# Altium schematic sheet 1-Connectors.SchDoc
size A4
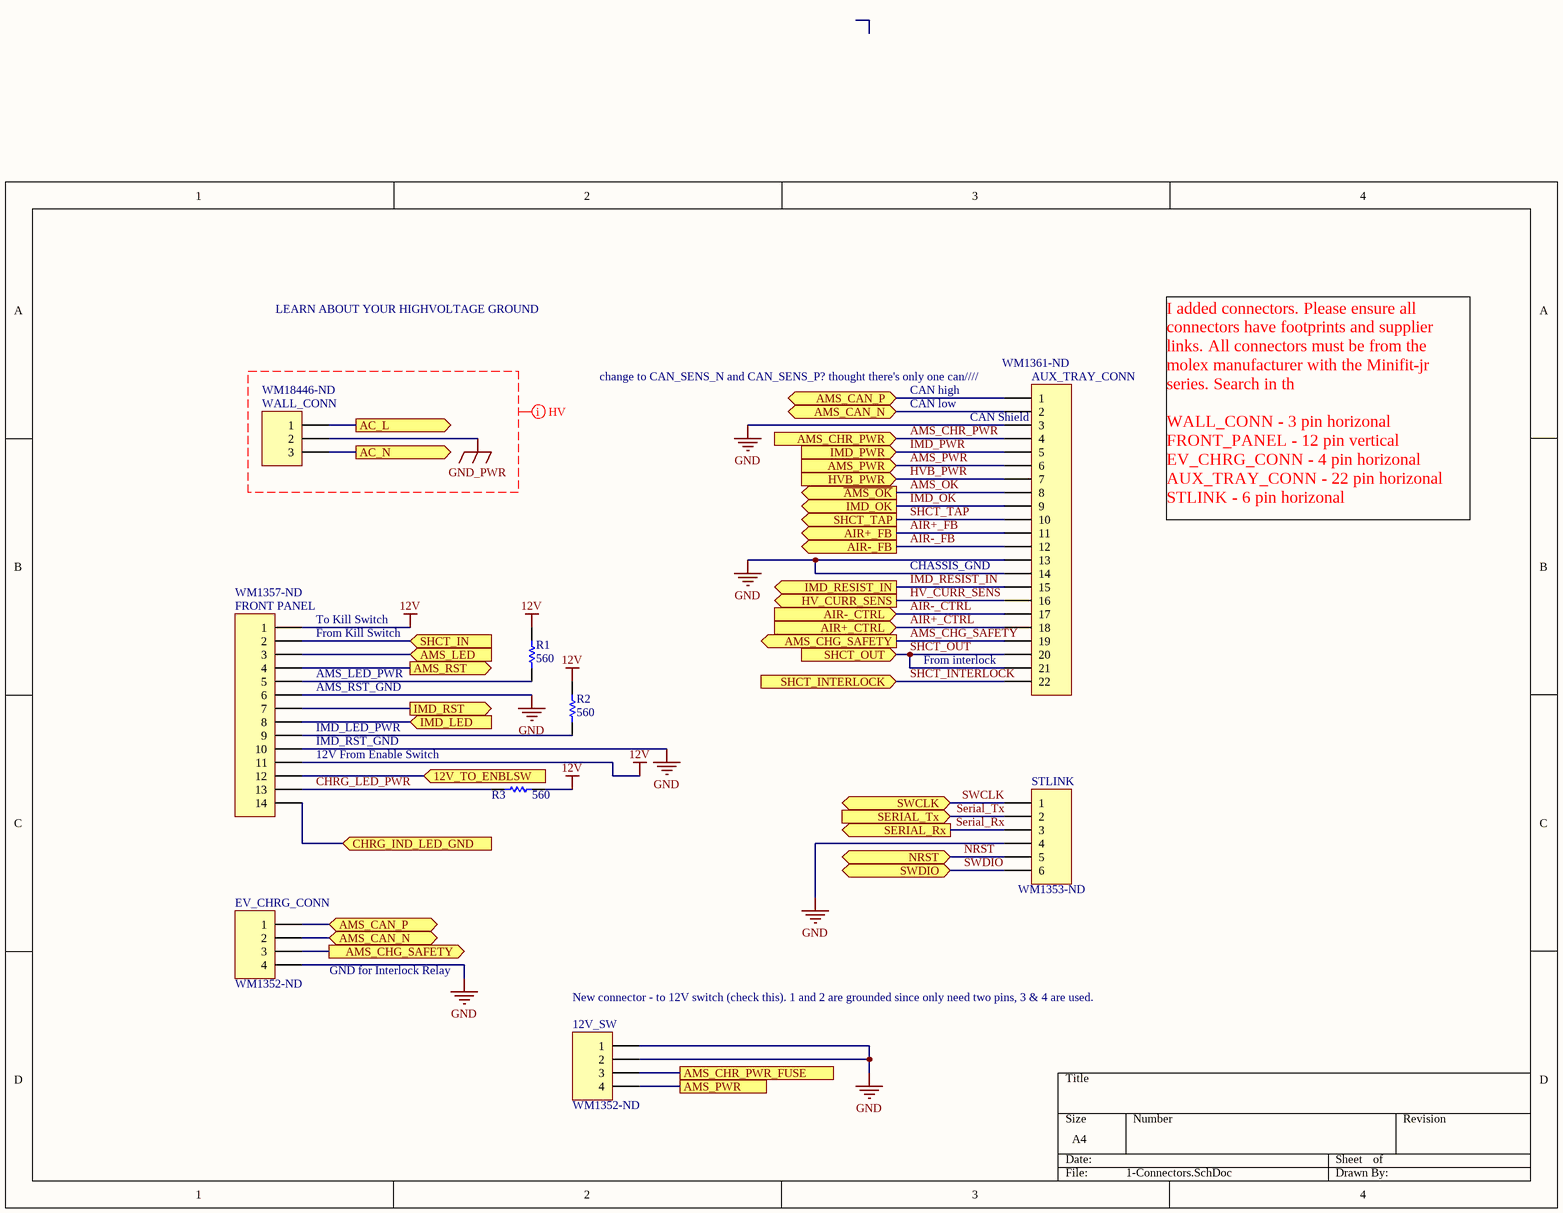
[diagram p0: 1-Connectors.SchDoc]

## Parts
12V_SW  Header 4  [WM1352-ND]  (value not drawn)
AUX_TRAY_CONN  (no value)  [WM1361-ND]
EV_CHRG_CONN  Header 4  [WM1352-ND]  (value not drawn)
FRONT_PANEL  (no value)  [WM1357-ND]
R1  560  [RESC0603(1608)_L]
R2  560  [RESC0603(1608)_L]
R3  560  [RESC0603(1608)_L]
STLINK  Header 6  [WM1353-ND]  (value not drawn)
WALL_CONN  Header 3  [WM18446-ND]  (value not drawn)

## Ports
12V_TO_ENBLSW (in), AC_L (out), AC_N (out), AIR+_CTRL (in), AIR+_FB (out), AIR-_CTRL (in), AIR-_FB (out), AMS_CAN_N (bidir), AMS_CAN_P (bidir), AMS_CHG_SAFETY (out), AMS_CHR_PWR (in), AMS_CHR_PWR_FUSE, AMS_LED (in), AMS_PWR, AMS_PWR (in), AMS_RST (out), CHRG_IND_LED_GND (in), HV_CURR_SENS (out), HVB_PWR (in), IMD_LED (in), IMD_OK (out), IMD_PWR (in), IMD_RESIST_IN (out), IMD_RST (out), NRST (bidir), SERIAL_Rx (out), SERIAL_Tx (in), SHCT_IN (in), SHCT_INTERLOCK (in), SHCT_OUT (in), SHCT_TAP (out), SWCLK (bidir), SWDIO (bidir), ~{AMS_OK} (out)

## Nets
12V: FRONT_PANEL.1 FRONT_PANEL.11 R1.2 R2.2 R3.1
GND: 12V_SW.1 12V_SW.2 AUX_TRAY_CONN.3 AUX_TRAY_CONN.13 AUX_TRAY_CONN.14 EV_CHRG_CONN.4 FRONT_PANEL.6 FRONT_PANEL.10 STLINK.4
GND_PWR: WALL_CONN.2
12V_TO_ENBLSW: FRONT_PANEL.12 ; port 12V_TO_ENBLSW
~{AMS_OK}: AUX_TRAY_CONN.8 ; port ~{AMS_OK}
AC_L: WALL_CONN.1 ; port AC_L
AC_N: WALL_CONN.3 ; port AC_N
AIR+_CTRL: AUX_TRAY_CONN.18 ; port AIR+_CTRL
AIR+_FB: AUX_TRAY_CONN.11 ; port AIR+_FB
AIR-_CTRL: AUX_TRAY_CONN.17 ; port AIR-_CTRL
AIR-_FB: AUX_TRAY_CONN.12 ; port AIR-_FB
AMS_CAN_N: AUX_TRAY_CONN.2 EV_CHRG_CONN.2 ; port AMS_CAN_N
AMS_CAN_P: AUX_TRAY_CONN.1 EV_CHRG_CONN.1 ; port AMS_CAN_P
AMS_CHG_SAFETY: AUX_TRAY_CONN.19 EV_CHRG_CONN.3 ; port AMS_CHG_SAFETY
AMS_CHR_PWR: AUX_TRAY_CONN.4 ; port AMS_CHR_PWR
AMS_CHR_PWR_FUSE: 12V_SW.3 ; port AMS_CHR_PWR_FUSE
AMS_LED: FRONT_PANEL.3 ; port AMS_LED
AMS_PWR: 12V_SW.4 AUX_TRAY_CONN.6 ; port AMS_PWR
AMS_RST: FRONT_PANEL.4 ; port AMS_RST
CHRG_IND_LED_GND: FRONT_PANEL.14 ; port CHRG_IND_LED_GND
CHRG_LED_PWR: FRONT_PANEL.13 R3.2
HV_CURR_SENS: AUX_TRAY_CONN.16 ; port HV_CURR_SENS
HVB_PWR: AUX_TRAY_CONN.7 ; port HVB_PWR
IMD_LED: FRONT_PANEL.8 ; port IMD_LED
IMD_OK: AUX_TRAY_CONN.9 ; port IMD_OK
IMD_PWR: AUX_TRAY_CONN.5 ; port IMD_PWR
IMD_RESIST_IN: AUX_TRAY_CONN.15 ; port IMD_RESIST_IN
IMD_RST: FRONT_PANEL.7 ; port IMD_RST
NRST: STLINK.5 ; port NRST
Serial_Rx: STLINK.3 ; port SERIAL_Rx
Serial_Tx: STLINK.2 ; port SERIAL_Tx
SHCT_IN: FRONT_PANEL.2 ; port SHCT_IN
SHCT_INTERLOCK: AUX_TRAY_CONN.22 ; port SHCT_INTERLOCK
SHCT_OUT: AUX_TRAY_CONN.20 AUX_TRAY_CONN.21 ; port SHCT_OUT
SHCT_TAP: AUX_TRAY_CONN.10 ; port SHCT_TAP
SWCLK: STLINK.1 ; port SWCLK
SWDIO: STLINK.6 ; port SWDIO
NetFRONT_PANEL_5: FRONT_PANEL.5 R1.1
NetFRONT_PANEL_9: FRONT_PANEL.9 R2.1

## Layout directives
mark named HV: GND_PWR

## Notes on the sheet
- LEARN ABOUT YOUR HIGHVOLTAGE GROUND
- (near AUX_TRAY_CONN) change to CAN_SENS_N and CAN_SENS_P? thought there's only one can////
- CAN high
- CAN low
- CAN Shield
- I added connectors. Please ensure all connectors have footprints and supplier links. All connectors must be from the molex manufacturer with the Minifit-jr series. Search in th
  WALL_CONN - 3 pin horizonal
  FRONT_PANEL - 12 pin vertical
  EV_CHRG_CONN - 4 pin horizonal
  AUX_TRAY_CONN - 22 pin horizonal
  STLINK - 6 pin horizonal
- (near FRONT_PANEL) To Kill Switch
- CHASSIS_GND
- (near FRONT_PANEL) From Kill Switch
- (near FRONT_PANEL) AMS_LED_PWR
- (near FRONT_PANEL) AMS_RST_GND
- (near AUX_TRAY_CONN) From interlock
- (near FRONT_PANEL) IMD_LED_PWR
- (near FRONT_PANEL) IMD_RST_GND
- 12V From Enable Switch
- GND for Interlock Relay
- (near 12V_SW) New connector - to 12V switch (check this). 1 and 2 are grounded since only need two pins, 3 & 4 are used.

## Library data of the parts
12V_SW EV_CHRG_CONN = Header 4: Header, 4-Pin; LatestRevisionDate: 17-Jul-2002; LatestRevisionNote: Re-released for DXP Platform.; Publisher: Altium Limited; Supplier 1: Digi-Key; Supplier Part Number 1: WM1352-ND
AUX_TRAY_CONN = Header 22: Header, 22-Pin; LatestRevisionDate: 17-Jul-2002; LatestRevisionNote: Re-released for DXP Platform.; Publisher: Altium Limited; Supplier 1: Digi-Key; Supplier Part Number 1: WM1361-ND
FRONT_PANEL = Header 14: Header, 14-Pin; LatestRevisionDate: 17-Jul-2002; LatestRevisionNote: Re-released for DXP Platform.; Publisher: Altium Limited; Supplier 1: Digi-Key; Supplier Part Number 1: WM1357-ND
R1-R3 = CMP-1591-00001-1: 0603 (1608 Metric) Chip Resistor; Case-Metric: 1608; Case-EIA: 0603; PackageReference: RESC0603(1608); Supplier 1: Digi-Key; Supplier Part Number 1: P560BZCT-ND
STLINK = Header 6: Header, 6-Pin; LatestRevisionDate: 17-Jul-2002; LatestRevisionNote: Re-released for DXP Platform.; Publisher: Altium Limited; Supplier 1: Digi-Key; Supplier Part Number 1: WM1353-ND
WALL_CONN = Header 3: Header, 3-Pin; LatestRevisionDate: 17-Jul-2002; LatestRevisionNote: Re-released for DXP Platform.; Publisher: Altium Limited; Supplier 1: Digi-Key; Supplier Part Number 1: WM18446-ND